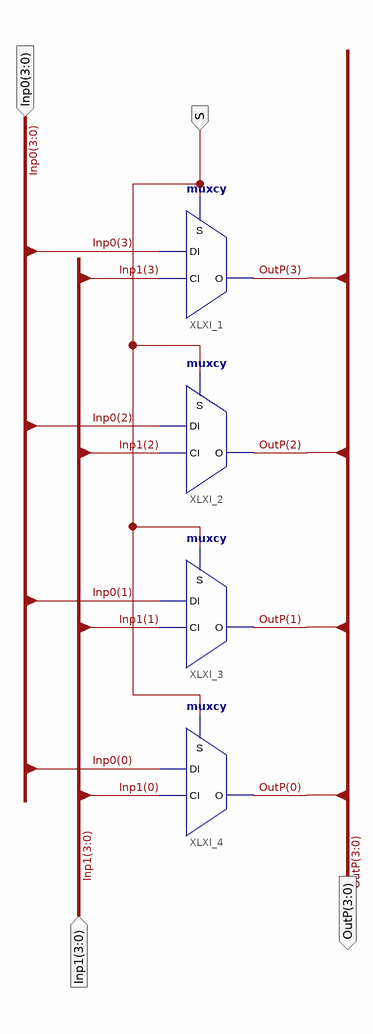
[diagram p0: schematic sheet 1]
// Xilinx ISE schematic Mux_2_4bit.sch (spartan3e) as structural Verilog: 4 symbols, 4 ports
module Mux_2_4bit (
  input  S,
  input  [3:0] Inp0,
  input  [3:0] Inp1,
  output [3:0] OutP
);

  muxcy XLXI_1 (.CI(Inp1[3]), .DI(Inp0[3]), .S(S), .O(OutP[3]));
  muxcy XLXI_2 (.CI(Inp1[2]), .DI(Inp0[2]), .S(S), .O(OutP[2]));
  muxcy XLXI_3 (.CI(Inp1[1]), .DI(Inp0[1]), .S(S), .O(OutP[1]));
  muxcy XLXI_4 (.CI(Inp1[0]), .DI(Inp0[0]), .S(S), .O(OutP[0]));
endmodule
